# Altium schematic sheet 11.RK3588_OSC_PLL_PMUIO.SchDoc
size 420 x 297 mm; Revision: V2.1; Schematic Page Number: 11; Page Number: 11; Check: <Checker>; Schematic Name: RK_NVR_DEMO1_RK3588_LP4/4x_V21; Page Count: 43; Page name: 11.RK3588_OSC/PLL/PMUIO; Designer: Zhangdz; Schematic Page Count: 99; Revcode: V2.1; DsnPath: E:\Work\SBER\RK3588_SOM\temp\RK_NVR_DEMO1_RK3588_LP4XD200P232SD8_V21_20211228.DSN; SchematicName: RK_NVR_DEMO1_RK3588_LP4/4x_V21; PageName: 11.RK3588_OSC/PLL/PMUIO; PageSize: A3; TopSchematic: True
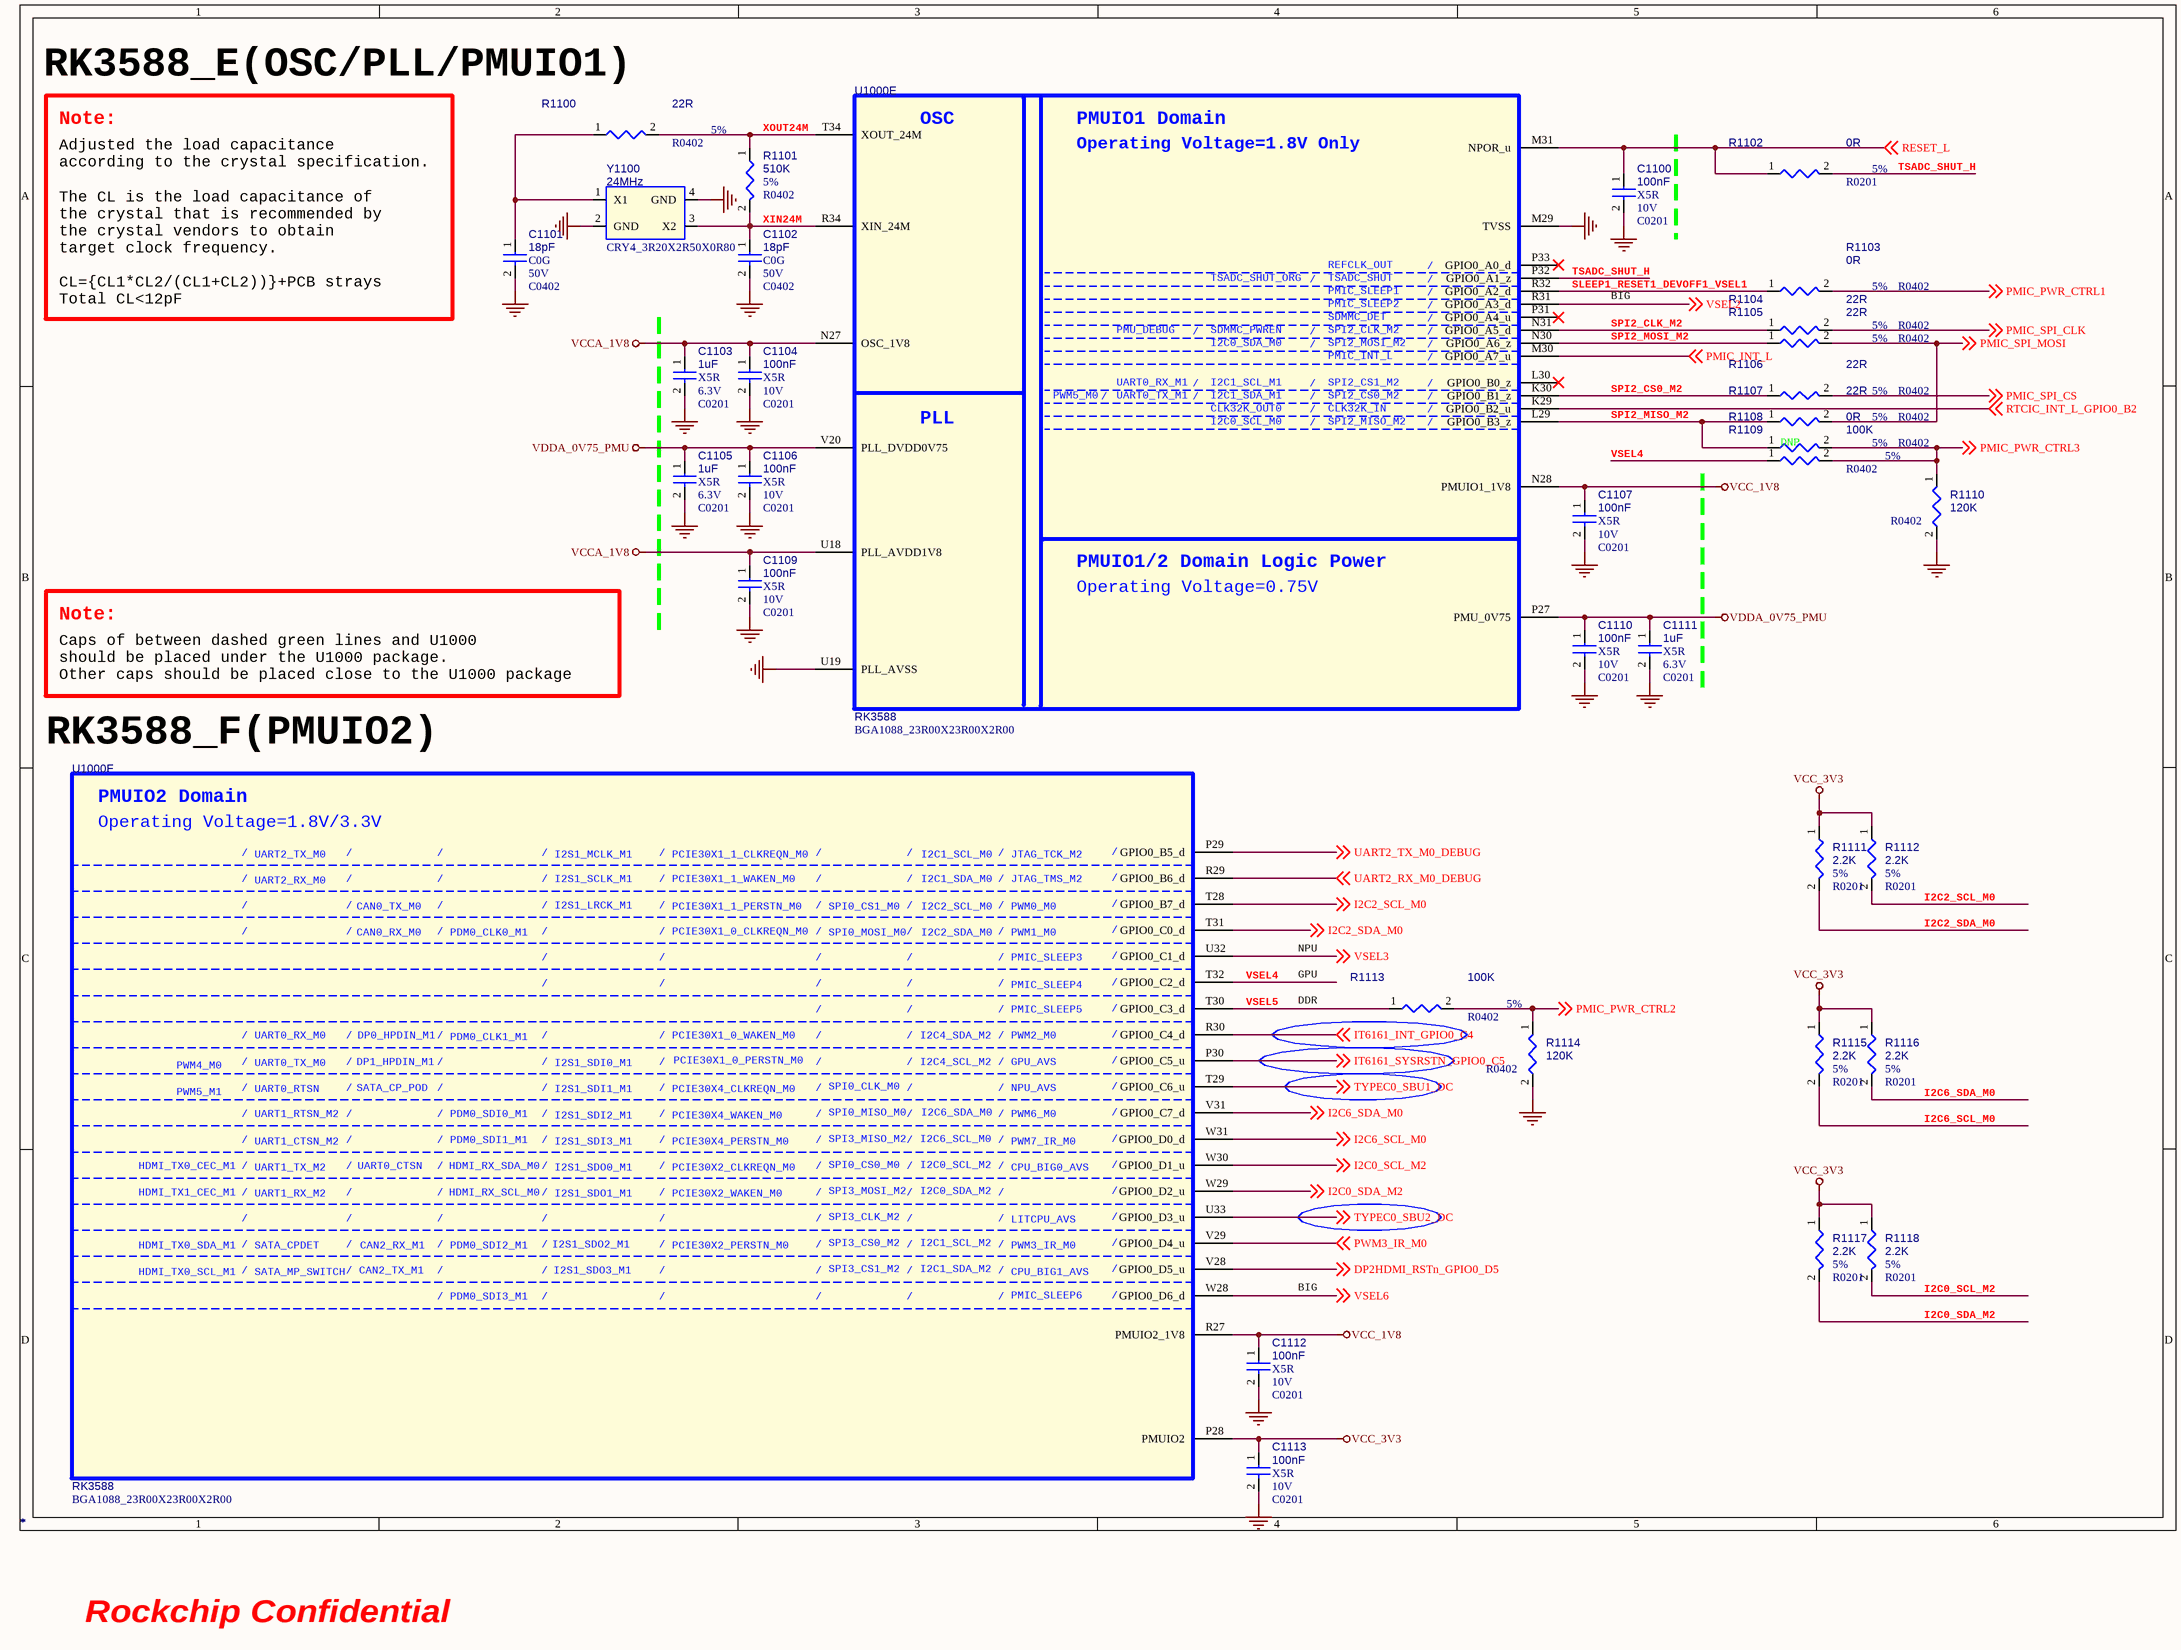
[diagram p0: 11.RK3588_OSC_PLL_PMUIO.SchDoc]

## Parts
C1100  *  Voltage: 10V  Dielectric: X5R  [C0201]
C1101  *  Voltage: 50V  Dielectric: C0G  [C0402]
C1102  *  Voltage: 50V  Dielectric: C0G  [C0402]
C1103  *  Voltage: 6.3V  Dielectric: X5R  [C0201]
C1104  *  Voltage: 10V  Dielectric: X5R  [C0201]
C1105  *  Voltage: 6.3V  Dielectric: X5R  [C0201]
C1106  *  Voltage: 10V  Dielectric: X5R  [C0201]
C1107  *  Voltage: 10V  Dielectric: X5R  [C0201]
C1109  *  Voltage: 10V  Dielectric: X5R  [C0201]
C1110  *  Voltage: 10V  Dielectric: X5R  [C0201]
C1111  *  Voltage: 6.3V  Dielectric: X5R  [C0201]
C1112  *  Voltage: 10V  Dielectric: X5R  [C0201]
C1113  *  Voltage: 10V  Dielectric: X5R  [C0201]
R1100  *  Tolerance: 5%  [R0402]
R1101  *  Tolerance: 5%  [R0402]
R1102  *  PCB Footprint: R0201  Tolerance: 5%  [R0402]
R1103  *  Tolerance: 5%  [R0402]
R1104  *  Tolerance: 5%  [R0402]
R1105  *  Tolerance: 5%  [R0402]
R1106  *  Tolerance: 5%  [R0402]
R1107  *  Tolerance: 5%  [R0402]
R1108  *  Tolerance: 5%  OPTION: DNP  [R0402]
R1109  *  Tolerance: 5%  [R0402]
R1110  *  [R0402]
R1111  *  PCB Footprint: R0201  Tolerance: 5%  [R0402]
R1112  *  PCB Footprint: R0201  Tolerance: 5%  [R0402]
R1113  *  Tolerance: 5%  [R0402]
R1114  *  [R0402]
R1115  *  PCB Footprint: R0201  Tolerance: 5%  [R0402]
R1116  *  PCB Footprint: R0201  Tolerance: 5%  [R0402]
R1117  *  PCB Footprint: R0201  Tolerance: 5%  [R0402]
R1118  *  PCB Footprint: R0201  Tolerance: 5%  [R0402]
U1000  *  [BGA1088_23R00X23R00X2R00]  (parts E,F of 26)
Y1100  *  PCB Footprint: CRY4_3R20X2R50X0R80  [CRY-3225]

## Nets
GND: C1100.2 C1101.2 C1102.2 C1103.2 C1104.2 C1105.2 C1106.2 C1107.2 C1109.2 C1110.2 C1111.2 C1112.2 C1113.2 R1110.2 R1114.2 U1000.M29(TVSS) U1000.U19(PLL_AVSS) Y1100.2(GND) Y1100.4(GND)
VCC_1V8: C1107.1 C1112.1 U1000.N28(PMUIO1_1V8) U1000.R27(PMUIO2_1V8)
VCC_3V3: C1113.1 R1111.1 R1112.1 R1115.1 R1116.1 R1117.1 R1118.1 U1000.P28(PMUIO2)
VCCA_1V8: C1103.1 C1104.1 C1109.1 U1000.N27(OSC_1V8) U1000.U18(PLL_AVDD1V8)
VDDA_0V75_PMU: C1105.1 C1106.1 C1110.1 C1111.1 U1000.P27(PMU_0V75) U1000.V20(PLL_DVDD0V75)
DP2HDMI_RSTn_GPIO0_D5: U1000.V28(GPIO0_D5_u) ; off-sheet DP2HDMI_RSTn_GPIO0_D5
I2C0_SCL_M2: R1118.2 U1000.W30(GPIO0_D1_u) ; off-sheet I2C0_SCL_M2
I2C0_SDA_M2: R1117.2 U1000.W29(GPIO0_D2_u) ; off-sheet I2C0_SDA_M2
I2C2_SCL_M0: R1112.2 U1000.T28(GPIO0_B7_d) ; off-sheet I2C2_SCL_M0
I2C2_SDA_M0: R1111.2 U1000.T31(GPIO0_C0_d) ; off-sheet I2C2_SDA_M0
I2C6_SCL_M0: R1115.2 U1000.W31(GPIO0_D0_d) ; off-sheet I2C6_SCL_M0
I2C6_SDA_M0: R1116.2 U1000.V31(GPIO0_C7_d) ; off-sheet I2C6_SDA_M0
IT6161_INT_GPIO0_C4: U1000.R30(GPIO0_C4_d) ; off-sheet IT6161_INT_GPIO0_C4
IT6161_SYSRSTN_GPIO0_C5: U1000.P30(GPIO0_C5_u) ; off-sheet IT6161_SYSRSTN_GPIO0_C5
PMIC_INT_L: U1000.M30(GPIO0_A7_u) ; off-sheet PMIC_INT_L
PMIC_PWR_CTRL1: R1103.2 ; off-sheet PMIC_PWR_CTRL1
PMIC_PWR_CTRL2: R1113.2 R1114.1 ; off-sheet PMIC_PWR_CTRL2
PMIC_PWR_CTRL3: R1108.2 R1109.2 R1110.1 ; off-sheet PMIC_PWR_CTRL3
PMIC_SPI_CLK: R1104.2 ; off-sheet PMIC_SPI_CLK
PMIC_SPI_CS: R1106.2 ; off-sheet PMIC_SPI_CS
PMIC_SPI_MOSI: R1105.2 R1107.2 ; off-sheet PMIC_SPI_MOSI
PWM3_IR_M0: U1000.V29(GPIO0_D4_u) ; off-sheet PWM3_IR_M0
RESET_L: C1100.1 R1102.1 U1000.M31(NPOR_u) ; off-sheet RESET_L
RTCIC_INT_L_GPIO0_B2: U1000.K29(GPIO0_B2_u) ; off-sheet RTCIC_INT_L_GPIO0_B2
SLEEP1_RESET1_DEVOFF1_VSEL1: R1103.1 U1000.R32(GPIO0_A2_d)
SPI2_CLK_M2: R1104.1 U1000.N31(GPIO0_A5_d)
SPI2_CS0_M2: R1106.1 U1000.K30(GPIO0_B1_z)
SPI2_MISO_M2: R1107.1 R1108.1 U1000.L29(GPIO0_B3_z)
SPI2_MOSI_M2: R1105.1 U1000.N30(GPIO0_A6_z)
TSADC_SHUT_H: R1102.2 U1000.P32(GPIO0_A1_z)
TYPEC0_SBU1_DC: U1000.T29(GPIO0_C6_u) ; off-sheet TYPEC0_SBU1_DC
TYPEC0_SBU2_DC: U1000.U33(GPIO0_D3_u) ; off-sheet TYPEC0_SBU2_DC
UART2_RX_M0_DEBUG: U1000.R29(GPIO0_B6_d) ; off-sheet UART2_RX_M0_DEBUG
UART2_TX_M0_DEBUG: U1000.P29(GPIO0_B5_d) ; off-sheet UART2_TX_M0_DEBUG
VSEL2: U1000.R31(GPIO0_A3_d) ; off-sheet VSEL2
VSEL3: U1000.U32(GPIO0_C1_d) ; off-sheet VSEL3
VSEL4: R1109.1 U1000.T32(GPIO0_C2_d)
VSEL5: R1113.1 U1000.T30(GPIO0_C3_d)
VSEL6: U1000.W28(GPIO0_D6_d) ; off-sheet VSEL6
XIN24M: C1102.1 R1101.2 U1000.R34(XIN_24M) Y1100.3(X2)
XOUT24M: R1100.2 R1101.1 U1000.T34(XOUT_24M)
NetC1101_1: C1101.1 R1100.1 Y1100.1(X1)

Not connected (* = marked no-connect by the designer): U1000 L30(GPIO0_B0_z)* P31(GPIO0_A4_u)* P33(GPIO0_A0_d)*

## Notes on the sheet
- RK3588_E(OSC/PLL/PMUIO1)
- Note:
- Adjusted the load capacitance
  according to the crystal specification.
- The CL is the load capacitance of
  the crystal that is recommended by
  the crystal vendors to obtain
  target clock frequency.
  CL={CL1*CL2/(CL1+CL2))}+PCB strays
  Total CL<12pF
- BIG
- Caps of between dashed green lines and U1000
  should be placed under the U1000 package.
  Other caps should be placed close to the U1000 package
- RK3588_F(PMUIO2)
- NPU
- GPU
- DDR
- Rockchip Confidential
- (in symbol SOC_RK3588, part E) OSC; PMUIO1 Domain; Operating Voltage=1.8V Only; REFCLK_OUT; /; TSADC_SHUT_ORG; TSADC_SHUT; PMIC_SLEEP1; PMIC_SLEEP2; SDMMC_DET; PMU_DEBUG; SDMMC_PWREN; SPI2_CLK_M2; I2C0_SDA_M0; SPI2_MOSI_M2; PMIC_INT_L; UART0_RX_M1; I2C1_SCL_M1; SPI2_CS1_M2; PWM5_M0; UART0_TX_M1; I2C1_SDA_M1; SPI2_CS0_M2; CLK32K_OUT0; CLK32K_IN; PLL; I2C0_SCL_M0; SPI2_MISO_M2; PMUIO1/2 Domain Logic Power; Operating Voltage=0.75V
- (in symbol SOC_RK3588, part F) PMUIO2 Domain; Operating Voltage=1.8V/3.3V; /; UART2_TX_M0; I2S1_MCLK_M1; PCIE30X1_1_CLKREQN_M0; I2C1_SCL_M0; JTAG_TCK_M2; UART2_RX_M0; I2S1_SCLK_M1; PCIE30X1_1_WAKEN_M0; I2C1_SDA_M0; JTAG_TMS_M2; CAN0_TX_M0; I2S1_LRCK_M1; PCIE30X1_1_PERSTN_M0; SPI0_CS1_M0; I2C2_SCL_M0; PWM0_M0; CAN0_RX_M0; PDM0_CLK0_M1; PCIE30X1_0_CLKREQN_M0; SPI0_MOSI_M0; I2C2_SDA_M0; PWM1_M0; PMIC_SLEEP3; PMIC_SLEEP4; PMIC_SLEEP5; UART0_RX_M0; DP0_HPDIN_M1; PDM0_CLK1_M1; PCIE30X1_0_WAKEN_M0; I2C4_SDA_M2; PWM2_M0; UART0_TX_M0; DP1_HPDIN_M1; I2S1_SDI0_M1; PCIE30X1_0_PERSTN_M0; I2C4_SCL_M2; GPU_AVS; PWM4_M0; UART0_RTSN; SATA_CP_POD; I2S1_SDI1_M1; PCIE30X4_CLKREQN_M0; SPI0_CLK_M0; NPU_AVS; PWM5_M1; UART1_RTSN_M2; PDM0_SDI0_M1; I2S1_SDI2_M1; PCIE30X4_WAKEN_M0; SPI0_MISO_M0; I2C6_SDA_M0; PWM6_M0; UART1_CTSN_M2; PDM0_SDI1_M1; I2S1_SDI3_M1; PCIE30X4_PERSTN_M0; SPI3_MISO_M2; I2C6_SCL_M0; PWM7_IR_M0; HDMI_TX0_CEC_M1; UART1_TX_M2; UART0_CTSN; HDMI_RX_SDA_M0; I2S1_SDO0_M1; PCIE30X2_CLKREQN_M0; SPI0_CS0_M0; I2C0_SCL_M2; CPU_BIG0_AVS; HDMI_TX1_CEC_M1; UART1_RX_M2; HDMI_RX_SCL_M0; I2S1_SDO1_M1; PCIE30X2_WAKEN_M0; SPI3_MOSI_M2; I2C0_SDA_M2; SPI3_CLK_M2; LITCPU_AVS; HDMI_TX0_SDA_M1; SATA_CPDET; CAN2_RX_M1; PDM0_SDI2_M1; I2S1_SDO2_M1; PCIE30X2_PERSTN_M0; SPI3_CS0_M2; I2C1_SCL_M2; PWM3_IR_M0; HDMI_TX0_SCL_M1; SATA_MP_SWITCH; CAN2_TX_M1; I2S1_SDO3_M1; SPI3_CS1_M2; I2C1_SDA_M2; CPU_BIG1_AVS; PDM0_SDI3_M1; PMIC_SLEEP6

## Library data of the parts
C1100 = CAP NP: cap,100.00nF,+/-10%,10V,X5R,C0201; Part Reference: C1100; Manufacturer PN: C0603X5R1A104K030BC; Manufacturer: TDK; Value: 100nF; Tolerance: 10%; Priority: A; PCB Footprint: C0201; Created by: JJJ; Part Type: C0201; RK PN: C0603X5R1A104K030BC
C1101 = CAP NP: cap,18.00pF,+/-5%,50V,C0G,C0402; Part Reference: C1101; Manufacturer: TDK; Value: 18pF; Number: 37; RK PN: C1005C0G1H180J050BA; Priority: A; Tolerance: 5%; C_Voltage: 6.3V; PCB Footprint: C0402; Part Type: C0402; Manufacturer PN: C1005C0G1H180J050BA; Created by: JJJ
C1102 = CAP NP: cap,18.00pF,+/-5%,50V,C0G,C0402; Part Reference: C1102; Manufacturer: TDK; Value: 18pF; Number: 37; RK PN: C1005C0G1H180J050BA; Priority: A; Tolerance: 5%; C_Voltage: 6.3V; PCB Footprint: C0402; Part Type: C0402; Manufacturer PN: C1005C0G1H180J050BA; Created by: JJJ
C1103 = CAP NP: cap,1.00uF,+/-20%,6.3V,X5R,C0201; Part Reference: C1103; Manufacturer PN: C0603X5R0J105M030BC; Manufacturer: TDK; Value: 1uF; Tolerance: 20%; Priority: A; PCB Footprint: C0201; Created by: JJJ; Part Type: C0201; RK PN: C0603X5R0J105M030BC
C1104 = CAP NP: cap,100.00nF,+/-10%,10V,X5R,C0201; Part Reference: C1104; Manufacturer PN: C0603X5R1A104K030BC; Manufacturer: TDK; Value: 100nF; Tolerance: 10%; Priority: A; PCB Footprint: C0201; Created by: JJJ; Part Type: C0201; RK PN: C0603X5R1A104K030BC
C1105 = CAP NP: cap,1.00uF,+/-20%,6.3V,X5R,C0201; Part Reference: C1105; Manufacturer PN: C0603X5R0J105M030BC; Manufacturer: TDK; Value: 1uF; Tolerance: 20%; Priority: A; PCB Footprint: C0201; Created by: JJJ; Part Type: C0201; RK PN: C0603X5R0J105M030BC
C1106 = CAP NP: cap,100.00nF,+/-10%,10V,X5R,C0201; Part Reference: C1106; Manufacturer PN: C0603X5R1A104K030BC; Manufacturer: TDK; Value: 100nF; Tolerance: 10%; Priority: A; PCB Footprint: C0201; Created by: JJJ; Part Type: C0201; RK PN: C0603X5R1A104K030BC
C1107 = CAP NP: cap,100.00nF,+/-10%,10V,X5R,C0201; Part Reference: C1107; Manufacturer: TDK; Value: 100nF; RK PN: C0603X5R1A104K030BC; Priority: A; Tolerance: 10%; PCB Footprint: C0201; Part Type: C0201; Manufacturer PN: C0603X5R1A104K030BC; Created by: JJJ
C1109 = CAP NP: cap,100.00nF,+/-10%,10V,X5R,C0201; Part Reference: C1109; Manufacturer PN: C0603X5R1A104K030BC; Manufacturer: TDK; Value: 100nF; Tolerance: 10%; Priority: A; PCB Footprint: C0201; Created by: JJJ; Part Type: C0201; RK PN: C0603X5R1A104K030BC
C1110 = CAP NP: cap,100.00nF,+/-10%,10V,X5R,C0201; Part Reference: C1110; Manufacturer PN: C0603X5R1A104K030BC; Manufacturer: TDK; Value: 100nF; Tolerance: 10%; Priority: A; PCB Footprint: C0201; Created by: JJJ; Part Type: C0201; RK PN: C0603X5R1A104K030BC
C1111 = CAP NP: cap,1.00uF,+/-20%,6.3V,X5R,C0201; Part Reference: C1111; Manufacturer PN: C0603X5R0J105M030BC; Manufacturer: TDK; Value: 1uF; Tolerance: 20%; Priority: A; PCB Footprint: C0201; Created by: JJJ; Part Type: C0201; RK PN: C0603X5R0J105M030BC
C1112 = CAP NP: cap,100.00nF,+/-10%,10V,X5R,C0201; Part Reference: C1112; Manufacturer: TDK; Value: 100nF; RK PN: C0603X5R1A104K030BC; Priority: A; Tolerance: 10%; PCB Footprint: C0201; Part Type: C0201; Manufacturer PN: C0603X5R1A104K030BC; Created by: JJJ
C1113 = CAP NP: cap,100.00nF,+/-10%,10V,X5R,C0201; Part Reference: C1113; Manufacturer: TDK; Value: 100nF; RK PN: C0603X5R1A104K030BC; Priority: A; Tolerance: 10%; PCB Footprint: C0201; Part Type: C0201; Manufacturer PN: C0603X5R1A104K030BC; Created by: JJJ
R1100 = RESISTOR_Dup1: НЁУГєсД¤µзЧи,22R,+/-5%,R0402,1/16W.; Part Reference: R1100; Manufacturer PN: RC0402JR-0722RL; Manufacturer: YAGEO; Wattage: 1/16W; Priority: A; PCB Footprint: R0402; Value: 22R; Created by: YTL; Part Type: НЁУГєсД¤µзЧи; RK PN: RC0402JR-0722RL
R1101 = RESISTOR_Dup1: НЁУГєсД¤µзЧи,510K,+/-5%,R0402,1/16W.; Part Reference: R1101; Manufacturer PN: RC0402JR-07510KL; Manufacturer: YAGEO; Wattage: 1/16W; Priority: A; PCB Footprint: R0402; Value: 510K; Created by: YTL; Part Type: НЁУГєсД¤µзЧи; RK PN: RC0402JR-07510KL
R1102 = RESISTOR_Dup1: НЁУГєсД¤µзЧи,0R,+/-5%,R0201,1/20W.; Part Reference: R1102; Manufacturer: YAGEO; RK PN: RC0201JR-070RL; Priority: A; Wattage: 1/20W; Value: 0R; Part Type: НЁУГєсД¤µзЧи; Manufacturer PN: RC0201JR-070RL; Created by: YTL
R1103 = RESISTOR_Dup1: НЁУГєсД¤µзЧи,0R,+/-5%,R0402,1/16W.; Part Reference: R1103; Manufacturer PN: RC0402JR-070RL; Manufacturer: YAGEO; Wattage: 1/16W; Priority: A; PCB Footprint: R0402; Value: 0R; Created by: YTL; Part Type: НЁУГєсД¤µзЧи; RK PN: RC0402JR-070RL
R1104 = RESISTOR_Dup1: НЁУГєсД¤µзЧи,22R,+/-5%,R0402,1/16W.; Part Reference: R1104; Manufacturer PN: RC0402JR-0722RL; Manufacturer: YAGEO; Wattage: 1/16W; Priority: A; PCB Footprint: R0402; Value: 22R; Created by: YTL; Part Type: НЁУГєсД¤µзЧи; RK PN: RC0402JR-0722RL
R1105 = RESISTOR_Dup1: НЁУГєсД¤µзЧи,22R,+/-5%,R0402,1/16W.; Part Reference: R1105; Manufacturer: YAGEO; RK PN: RC0402JR-0722RL; Priority: A; Wattage: 1/16W; PCB Footprint: R0402; Value: 22R; Part Type: НЁУГєсД¤µзЧи; Manufacturer PN: RC0402JR-0722RL; Created by: YTL
R1106 = RESISTOR_Dup1: НЁУГєсД¤µзЧи,22R,+/-5%,R0402,1/16W.; Part Reference: R1106; Manufacturer PN: RC0402JR-0722RL; Manufacturer: YAGEO; Wattage: 1/16W; Priority: A; PCB Footprint: R0402; Value: 22R; Created by: YTL; Part Type: НЁУГєсД¤µзЧи; RK PN: RC0402JR-0722RL
R1107 = RESISTOR_Dup1: НЁУГєсД¤µзЧи,22R,+/-5%,R0402,1/16W.; Part Reference: R1107; Manufacturer: YAGEO; RK PN: RC0402JR-0722RL; Priority: A; Wattage: 1/16W; PCB Footprint: R0402; Value: 22R; Part Type: НЁУГєсД¤µзЧи; Manufacturer PN: RC0402JR-0722RL; Created by: YTL
R1108 = RESISTOR_Dup1: НЁУГєсД¤µзЧи,0R,+/-5%,R0402,1/16W.; Part Reference: R1108; Manufacturer: YAGEO; RK PN: RC0402JR-070RL; Priority: A; Wattage: 1/16W; PCB Footprint: R0402; Value: 0R; Part Type: НЁУГєсД¤µзЧи; Manufacturer PN: RC0402JR-070RL; Created by: YTL
R1109 = RESISTOR_Dup1: НЁУГєсД¤µзЧи,100K,+/-5%,R0402,1/16W.; Part Reference: R1109; Manufacturer: YAGEO; RK PN: RC0402JR-07100KL; Priority: A; Wattage: 1/16W; PCB Footprint: R0402; Value: 100K; Part Type: НЁУГєсД¤µзЧи; Manufacturer PN: RC0402JR-07100KL; Created by: YTL
R1110 = RESISTOR_Dup1: НЁУГєсД¤µзЧи,120K,+/-5%,R0402,1/16W.; Part Reference: R1110; Manufacturer PN: RC0402JR-07120KL; Manufacturer: YAGEO; Tolerance: 5%; Priority: A; Wattage: 1/16W; PCB Footprint: R0402; Value: 120K; Created by: YTL; Part Type: НЁУГєсД¤µзЧи; RK PN: RC0402JR-07120KL
R1111 = RESISTOR_Dup1: НЁУГєсД¤µзЧи,2K2,+/-5%,R0201,1/20W.; Part Reference: R1111; Manufacturer: YAGEO; Value: 2.2K; RK PN: RC0201JR-072K2L; Priority: A; Wattage: 1/20W; Part Type: НЁУГєсД¤µзЧи; Manufacturer PN: RC0201JR-072K2L; Created by: YTL
R1112 = RESISTOR_Dup1: НЁУГєсД¤µзЧи,2K2,+/-5%,R0201,1/20W.; Part Reference: R1112; Manufacturer PN: RC0201JR-072K2L; Manufacturer: YAGEO; Value: 2.2K; Wattage: 1/20W; Priority: A; Created by: YTL; Part Type: НЁУГєсД¤µзЧи; RK PN: RC0201JR-072K2L
R1113 = RESISTOR_Dup1: НЁУГєсД¤µзЧи,100K,+/-5%,R0402,1/16W.; Part Reference: R1113; Manufacturer: YAGEO; RK PN: RC0402JR-07100KL; Priority: A; Wattage: 1/16W; PCB Footprint: R0402; Value: 100K; Part Type: НЁУГєсД¤µзЧи; Manufacturer PN: RC0402JR-07100KL; Created by: YTL
R1114 = RESISTOR_Dup1: НЁУГєсД¤µзЧи,120K,+/-5%,R0402,1/16W.; Part Reference: R1114; Manufacturer PN: RC0402JR-07120KL; Manufacturer: YAGEO; Tolerance: 5%; Priority: A; Wattage: 1/16W; PCB Footprint: R0402; Value: 120K; Created by: YTL; Part Type: НЁУГєсД¤µзЧи; RK PN: RC0402JR-07120KL
R1115 = RESISTOR_Dup1: НЁУГєсД¤µзЧи,2K2,+/-5%,R0201,1/20W.; Part Reference: R1115; Manufacturer: YAGEO; Value: 2.2K; RK PN: RC0201JR-072K2L; Priority: A; Wattage: 1/20W; Part Type: НЁУГєсД¤µзЧи; Manufacturer PN: RC0201JR-072K2L; Created by: YTL
R1116 = RESISTOR_Dup1: НЁУГєсД¤µзЧи,2K2,+/-5%,R0201,1/20W.; Part Reference: R1116; Manufacturer PN: RC0201JR-072K2L; Manufacturer: YAGEO; Value: 2.2K; Wattage: 1/20W; Priority: A; Created by: YTL; Part Type: НЁУГєсД¤µзЧи; RK PN: RC0201JR-072K2L
R1117 = RESISTOR_Dup1: НЁУГєсД¤µзЧи,2K2,+/-5%,R0201,1/20W.; Part Reference: R1117; Manufacturer: YAGEO; Value: 2.2K; RK PN: RC0201JR-072K2L; Priority: A; Wattage: 1/20W; Part Type: НЁУГєсД¤µзЧи; Manufacturer PN: RC0201JR-072K2L; Created by: YTL
R1118 = RESISTOR_Dup1: НЁУГєсД¤µзЧи,2K2,+/-5%,R0201,1/20W.; Part Reference: R1118; Manufacturer PN: RC0201JR-072K2L; Manufacturer: YAGEO; Value: 2.2K; Wattage: 1/20W; Priority: A; Created by: YTL; Part Type: НЁУГєсД¤µзЧи; RK PN: RC0201JR-072K2L
U1000 = SOC_RK3588: ROCKCHIP SOC; Part Reference: U1000; Manufacturer: Rockchip (ИрРѕОў); SPLIT_INST: TRUE; SWAP_INFO: (S1+S2+S3+S4+S5+S6+S7+S8+S9+S10+S11+S12+S13+S14+S15+S16+S17+S18+S19+S20+S21+S22+S23+S24+S25+S26); Value: RK3588; Priority: A; RK PN: RK3588; Part Type: SOC; Manufacturer PN: RK3588; Created by: YWQ; PCB Footprint: BGA1088_23R00X23R00X2R00
Y1100 = CRYSTAL_4P: ОЮФґѕ§ХсЈ¬24MЈ¬3225,ЎА10ppmЈ¬8pFЈ¬Hosonic; Part Reference: Y1100; Manufacturer PN: E3SB24.0000F08E11; Manufacturer: Hosonic(єиРЗµзЧУ); Value: 24MHz; Priority: A; Created by: JJJ; Part Type: CRYSTAL; RK PN: E3SB24.0000F08E11